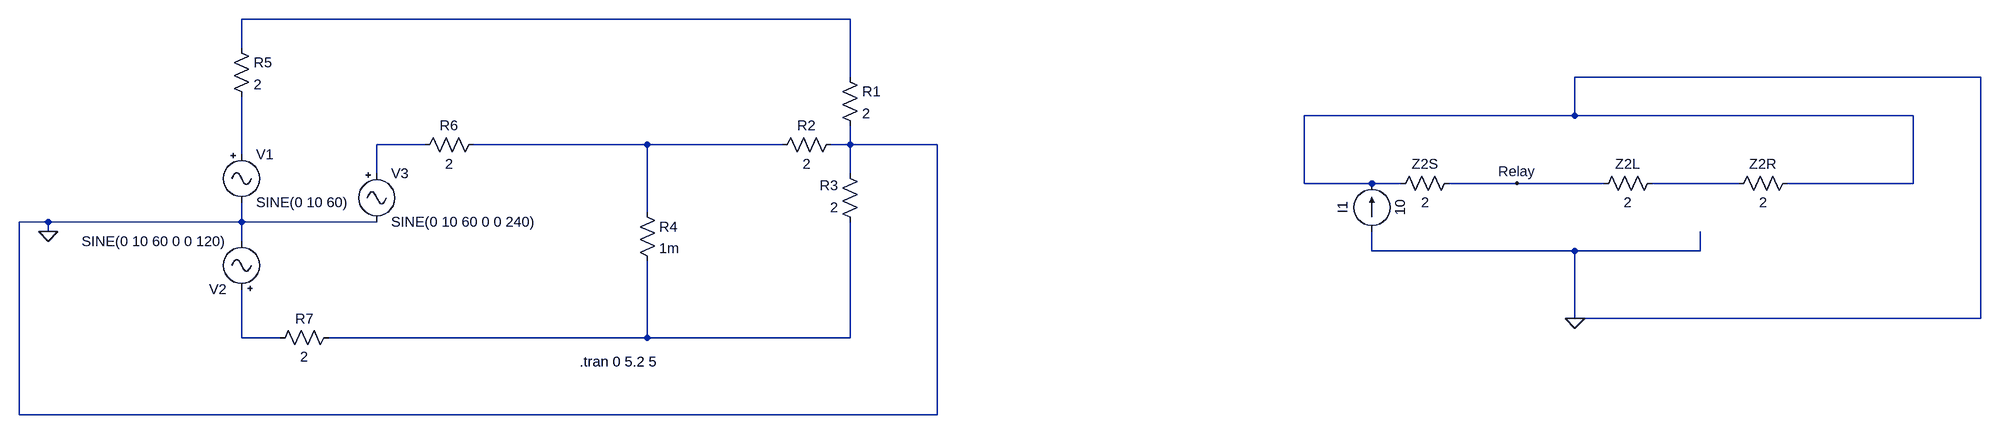
[diagram p0: schematic Symetrical_components_test.asc]
Symetrical_components_test.asc, the LTspice schematic file:
Version 4.1
SHEET 1 3028 680
WIRE 1152 -96 144 -96
WIRE 144 -48 144 -96
WIRE 1152 0 1152 -96
WIRE 3024 0 2352 0
WIRE 2352 64 2352 0
WIRE 2352 64 1904 64
WIRE 2912 64 2352 64
WIRE 448 112 368 112
WIRE 816 112 528 112
WIRE 1040 112 816 112
WIRE 1152 112 1152 80
WIRE 1152 112 1120 112
WIRE 1296 112 1152 112
WIRE 144 128 144 32
WIRE 368 160 368 112
WIRE 1152 160 1152 112
WIRE 1904 176 1904 64
WIRE 2016 176 1904 176
WIRE 2064 176 2016 176
WIRE 2256 176 2144 176
WIRE 2400 176 2256 176
WIRE 2624 176 2480 176
WIRE 2912 176 2912 64
WIRE 2912 176 2704 176
WIRE 816 224 816 112
WIRE -176 240 -224 240
WIRE 144 240 144 208
WIRE 144 240 -176 240
WIRE 368 240 144 240
WIRE -176 256 -176 240
WIRE 144 272 144 240
WIRE 2016 288 2016 256
WIRE 2352 288 2016 288
WIRE 2560 288 2560 256
WIRE 2560 288 2352 288
WIRE 2352 400 2352 288
WIRE 3024 400 3024 0
WIRE 3024 400 2352 400
WIRE 144 432 144 352
WIRE 208 432 144 432
WIRE 816 432 816 304
WIRE 816 432 288 432
WIRE 1152 432 1152 240
WIRE 1152 432 816 432
WIRE -224 560 -224 240
WIRE 1296 560 1296 112
WIRE 1296 560 -224 560
FLAG -176 256 0
FLAG 2256 176 Relay
FLAG 2352 400 0
SYMBOL Misc\\signal 144 112 R0
WINDOW 123 0 0 Left 0
WINDOW 39 0 0 Left 0
SYMATTR InstName V1
SYMATTR Value SINE(0 10 60)
SYMBOL Misc\\signal 144 368 R180
WINDOW 123 0 0 Left 0
WINDOW 39 0 0 Left 0
SYMATTR InstName V2
SYMATTR Value SINE(0 10 60 0 0 120)
SYMBOL Misc\\signal 368 144 R0
WINDOW 123 0 0 Left 0
WINDOW 39 0 0 Left 0
SYMATTR InstName V3
SYMATTR Value SINE(0 10 60 0 0 240)
SYMBOL res 1136 -16 R0
SYMATTR InstName R1
SYMATTR Value 2
SYMBOL res 1024 128 R270
WINDOW 0 32 56 VTop 2
WINDOW 3 0 56 VBottom 2
SYMATTR InstName R2
SYMATTR Value 2
SYMBOL res 1168 256 R180
WINDOW 0 36 76 Left 2
WINDOW 3 36 40 Left 2
SYMATTR InstName R3
SYMATTR Value 2
SYMBOL res 800 208 R0
SYMATTR InstName R4
SYMATTR Value 1m
SYMBOL res 128 -64 R0
SYMATTR InstName R5
SYMATTR Value 2
SYMBOL res 432 128 R270
WINDOW 0 32 56 VTop 2
WINDOW 3 0 56 VBottom 2
SYMATTR InstName R6
SYMATTR Value 2
SYMBOL res 192 448 R270
WINDOW 0 32 56 VTop 2
WINDOW 3 0 56 VBottom 2
SYMATTR InstName R7
SYMATTR Value 2
SYMBOL res 2048 192 R270
WINDOW 0 32 56 VTop 2
WINDOW 3 0 56 VBottom 2
SYMATTR InstName Z2S
SYMATTR Value 2
SYMBOL res 2496 160 R90
WINDOW 0 0 56 VBottom 2
WINDOW 3 32 56 VTop 2
SYMATTR InstName Z2L
SYMATTR Value 2
SYMBOL res 2720 160 R90
WINDOW 0 0 56 VBottom 2
WINDOW 3 32 56 VTop 2
SYMATTR InstName Z2R
SYMATTR Value 2
SYMBOL current 2016 256 R180
WINDOW 0 32 40 VTop 2
WINDOW 3 -32 40 VBottom 2
WINDOW 123 0 0 Left 0
WINDOW 39 0 0 Left 0
SYMATTR InstName I1
SYMATTR Value 10
TEXT 704 472 Left 2 !.tran 0 5.2 5

The netlist it stands for:
* Symetrical_components_test.asc
V1 N004 0 SINE(0 10 60)
V2 N006 0 SINE(0 10 60 0 0 120)
V3 N002 0 SINE(0 10 60 0 0 240)
R1 N001 0 2
R2 N003 0 2
R3 N007 0 2
R4 N003 N007 1m
R5 N001 N004 2
R6 N002 N003 2
R7 N006 N007 2
R§Z2S 0 Relay 2
R§Z2L N005 Relay 2
R§Z2R 0 N005 2
I1 0 0 10
.tran 0 5.2 5
.backanno
.end